# Altium project 双通道模组-测试第一版.PrjPCB
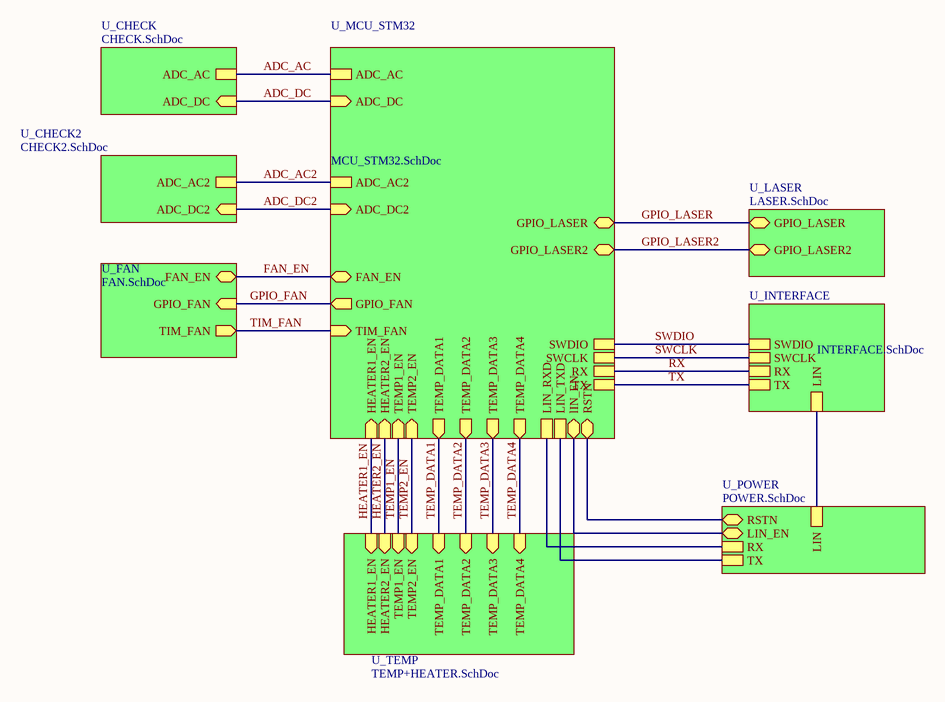
[diagram p0: B2-3-2.SchDoc]
9 sheets, 124 parts. Net scope: global (net labels, ports and power ports of the same name join across sheets).
Board files: B6-1-2.PcbDoc, B6V2.PcbDoc, PCB1.PcbDoc
Sheets:
  B2-3-2.SchDoc
    U_CHECK = CHECK.SchDoc
    U_FAN = FAN.SchDoc
    U_INTERFACE = INTERFACE.SchDoc
    U_LASER = LASER.SchDoc
    U_MCU_STM32 = MCU_STM32.SchDoc
    U_POWER = POWER.SchDoc
    U_CHECK2 = CHECK2.SchDoc
    U_TEMP = TEMP+HEATER.SchDoc

## Sheet B2-3-2.SchDoc
size A4

### Sub-sheets
U_CHECK = CHECK.SchDoc: ADC_AC, ADC_DC (in)
U_CHECK2 = CHECK2.SchDoc: ADC_AC2, ADC_DC2 (in)
U_FAN = FAN.SchDoc: GPIO_FAN (in), TIM_FAN (out), FAN_EN
U_INTERFACE = INTERFACE.SchDoc: SWDIO, SWCLK, RX, TX, LIN
U_LASER = LASER.SchDoc: GPIO_LASER, GPIO_LASER2
U_MCU_STM32 = MCU_STM32.SchDoc: ADC_AC, SWDIO, SWCLK, RX, TX, TIM_FAN (in), GPIO_FAN (out), GPIO_LASER, GPIO_LASER2, FAN_EN, ADC_AC2, TEMP_DATA2 (out), TEMP_DATA1 (out), TEMP_DATA3 (out), TEMP_DATA4 (out), LIN_TXD, LIN_RXD, lIN_EN, RSTN, ADC_DC (in), ADC_DC2 (in), TEMP2_EN (in), TEMP1_EN (in), HEATER2_EN (in), HEATER1_EN (in)
U_POWER = POWER.SchDoc: RX, TX, LIN, LIN_EN, RSTN
U_TEMP = TEMP+HEATER.SchDoc: TEMP_DATA2 (in), TEMP_DATA1 (in), TEMP_DATA3 (in), TEMP_DATA4 (in), TEMP1_EN (in), TEMP2_EN (in), HEATER2_EN (in), HEATER1_EN (in)

### Nets
ADC_AC: sheet U_CHECK/ADC_AC, sheet U_MCU_STM32/ADC_AC
ADC_AC2: sheet U_MCU_STM32/ADC_AC2, sheet U_CHECK2/ADC_AC2
ADC_DC: sheet U_CHECK/ADC_DC, sheet U_MCU_STM32/ADC_DC
ADC_DC2: sheet U_MCU_STM32/ADC_DC2, sheet U_CHECK2/ADC_DC2
FAN_EN: sheet U_FAN/FAN_EN, sheet U_MCU_STM32/FAN_EN
GPIO_FAN: sheet U_FAN/GPIO_FAN, sheet U_MCU_STM32/GPIO_FAN
GPIO_LASER: sheet U_LASER/GPIO_LASER, sheet U_MCU_STM32/GPIO_LASER
GPIO_LASER2: sheet U_LASER/GPIO_LASER2, sheet U_MCU_STM32/GPIO_LASER2
HEATER1_EN: sheet U_MCU_STM32/HEATER1_EN, sheet U_TEMP/HEATER1_EN
HEATER2_EN: sheet U_MCU_STM32/HEATER2_EN, sheet U_TEMP/HEATER2_EN
RX: sheet U_INTERFACE/RX, sheet U_MCU_STM32/RX
SWCLK: sheet U_INTERFACE/SWCLK, sheet U_MCU_STM32/SWCLK
SWDIO: sheet U_INTERFACE/SWDIO, sheet U_MCU_STM32/SWDIO
TEMP1_EN: sheet U_MCU_STM32/TEMP1_EN, sheet U_TEMP/TEMP1_EN
TEMP2_EN: sheet U_MCU_STM32/TEMP2_EN, sheet U_TEMP/TEMP2_EN
TEMP_DATA1: sheet U_MCU_STM32/TEMP_DATA1, sheet U_TEMP/TEMP_DATA1
TEMP_DATA2: sheet U_MCU_STM32/TEMP_DATA2, sheet U_TEMP/TEMP_DATA2
TEMP_DATA3: sheet U_MCU_STM32/TEMP_DATA3, sheet U_TEMP/TEMP_DATA3
TEMP_DATA4: sheet U_MCU_STM32/TEMP_DATA4, sheet U_TEMP/TEMP_DATA4
TIM_FAN: sheet U_FAN/TIM_FAN, sheet U_MCU_STM32/TIM_FAN
TX: sheet U_INTERFACE/TX, sheet U_MCU_STM32/TX
(unnamed): sheet U_INTERFACE/LIN, sheet U_POWER/LIN
(unnamed): sheet U_MCU_STM32/LIN_TXD, sheet U_POWER/TX
(unnamed): sheet U_MCU_STM32/LIN_RXD, sheet U_POWER/RX
(unnamed): sheet U_MCU_STM32/lIN_EN, sheet U_POWER/LIN_EN
(unnamed): sheet U_MCU_STM32/RSTN, sheet U_POWER/RSTN

## Sheet CHECK.SchDoc
size A4
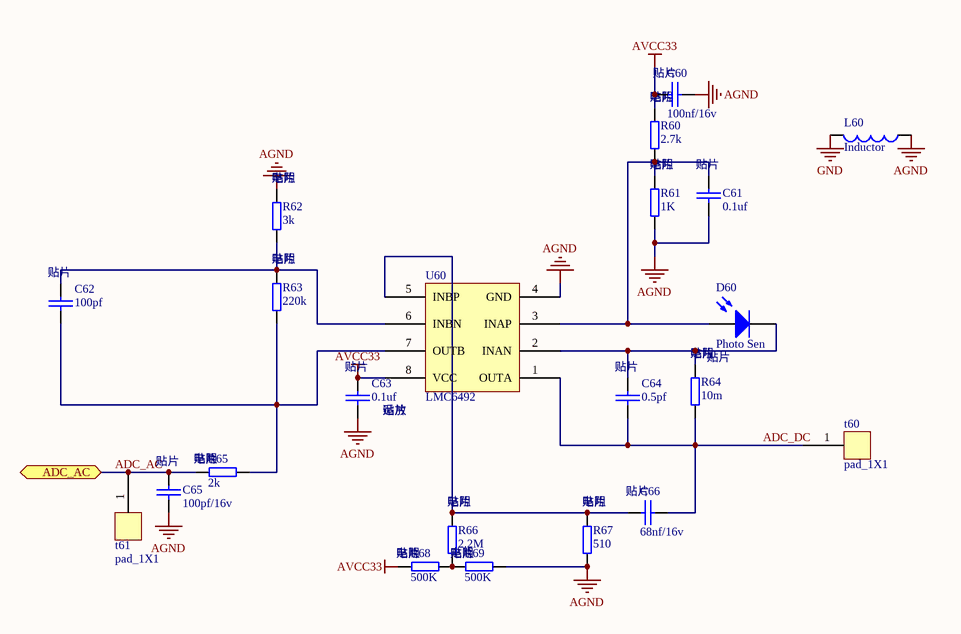
[diagram p1: CHECK.SchDoc]

### Parts
C60  100nf/16v  [C0402]
C61  0.1uf  [C0402]
C62  100pf  [C0402]
C63  0.1uf  [C0402]
C64  0.5pf  [C0402]
C65  100pf/16v  [C0402]
C66  68nf/16v  [C0402]
D60  Photo Sen  [PhotoSen]
L60  Inductor  [L0402]
R60  2.7k  [R0402]
R61  1K  [R0402]
R62  3k  [R0402]
R63  220k  [R0402]
R64  10m  [R0402]
R65  2k  [R0402]
R66  2.2M  [R0402]
R67  510  [R0402]
R68  500K  [R0402]
R69  500K  [R0402]
t60  pad_1X1  [pad_0603]
t61  pad_1X1  [pad_0603]
U60  LMC6492  [SO-8]

### Ports
ADC_AC

### Nets
AGND: C60.2 C61.2 C63.2 C65.1 L60.1 R61.2 R62.1 R67.2 R69.2 U60.4(GND)
AVCC33: C60.1 C63.1 R60.1 R68.1 U60.8(VCC)
GND: L60.2
ADC_AC: C65.2 R65.1 t61.1 ; port ADC_AC
ADC_DC: C64.2 C66.2 R64.2 t60.1 U60.1(OUTA)
NetC61_1: C61.1 D60.1(A) R60.2 R61.1 U60.3(INAP)
NetC62_1: C62.1 R62.2 R63.1 U60.6(INBN)
NetC62_2: C62.2 R63.2 R65.2 U60.7(OUTB)
NetC64_1: C64.1 D60.2(K) R64.1 U60.2(INAN)
NetC66_1: C66.1 R66.1 R67.1 U60.5(INBP)
NetR66_2: R66.2 R68.2 R69.1

### Notes on the sheet
- (in symbol CC) 贴片
- (in symbol LMC6492) 贴片; 运放
- (in symbol Photo Sen) 贴片
- (in symbol RES1) 电阻; 贴片

### Library data of the parts
C60 C61 C63 = CC: C; 大?: 0.1uf/50v; 封?: 0603
C62 C65 = CC: C; 大?: 100pF/50v; 封?: 0603
C64 = CC: C; 大?: 0.5pf/50v; 封?: 0603
C66 = CC: C; 大?: 68nf/50v; 封?: 0603
D60 = Photo Sen: Photosensitive Diode; 产?: *; 厂?: *; 大?: *; 封?: *; 价?: *; 型?: *; 资?: *
L60 = Inductor: Code_IEC: 1005; Published: 8-Jun-2000; LatestRevisionDate: 29-May-2009; LatestRevisionNote: IPC-7351 Footprint Added.; PackageReference: 0402-A; Publisher: Altium Limited; PackageDescription: Chip Inductor; Code_JEITA: 0402
R60-R69 = RES1: R; 价?: 0.01; 封?: 0603
  R60: 大?: 2.7k
  R61: 大?: 1k
  R62: 大?: 3k
  R63: 大?: 220k
  R64: 大?: 10m
  R65: 大?: 2k
  R66: 大?: 2.2M
  R67: 大?: 510
  R68 R69: 大?: 500K
U60 = LMC6492: 产?: *; 厂?: *; 大?: *; 封?: *; 价?: *; 型?: LMC6492; 资?: *

## Sheet FAN.SchDoc
size A4
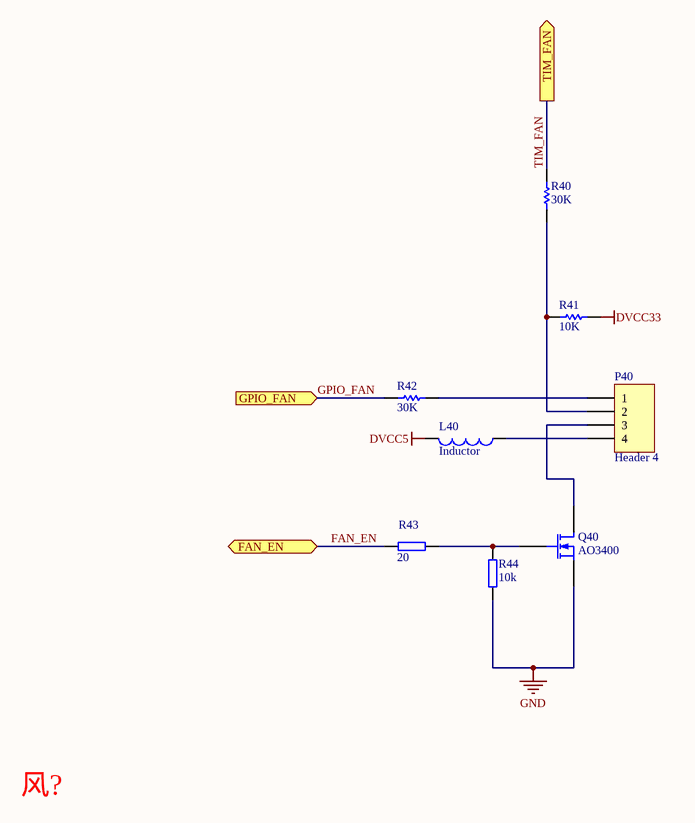
[diagram p2: FAN.SchDoc]

### Parts
L40  Inductor  [L0402]
P40  Header 4  [1.5P-4]
Q40  AO3400  [SI2300]
R40  30K  [R0402]
R41  10K  [R0402]
R42  30K  [R0402]
R43  20  [R0402]
R44  10k  [R0402]

### Ports
FAN_EN, GPIO_FAN (in), TIM_FAN (out)

### Nets
DVCC5: L40.2
DVCC33: R41.1
GND: Q40.3(S) R44.2
FAN_EN: R43.2 ; port FAN_EN
GPIO_FAN: R42.1 ; port GPIO_FAN
TIM_FAN: R40.2 ; port TIM_FAN
NetL40_1: L40.1 P40.4
NetP40_1: P40.1 R42.2
NetP40_2: P40.2 R40.1 R41.2
NetP40_3: P40.3 Q40.1(D)
NetQ40_2: Q40.2(G) R43.1 R44.1

### Notes on the sheet
- 风?

### Library data of the parts
L40 = Inductor: Code_IEC: 1005; Published: 8-Jun-2000; LatestRevisionDate: 29-May-2009; LatestRevisionNote: IPC-7351 Footprint Added.; PackageReference: 0402-A; Publisher: Altium Limited; PackageDescription: Chip Inductor; Code_JEITA: 0402
P40 = Header 4: Header, 4-Pin; LatestRevisionDate: 17-Jul-2002; LatestRevisionNote: Re-released for DXP Platform.; Publisher: Altium Limited
Q40 = MOSFET-N: N-Channel MOSFET; pin to pad: 1>3 2>1 3>2; ·: 贴片; 元件�: N-MOS; 产地: *; 厂商: *; 大小: *; 封装�: *; 型号: AO3400; 物料�: *
R40 R42 = R0402: Resistor 0402; Published: 8-Jun-2000; LatestRevisionDate: 17-Jul-2002; LatestRevisionNote: Re-released for DXP Platform.; PackageReference: AXIAL-0.3; Publisher: Altium Limited; PackageDescription: Axial Device, Thru-Hole; 2 Leads; 0.3 in Pin Spacing; Value: 30K
R41 = R0402: Resistor 0402; Value: 1K; Published: 8-Jun-2000; LatestRevisionDate: 17-Jul-2002; LatestRevisionNote: Re-released for DXP Platform.; PackageReference: AXIAL-0.3; Publisher: Altium Limited; PackageDescription: Axial Device, Thru-Hole; 2 Leads; 0.3 in Pin Spacing
R43 R44 = RES1: Ô: 电阻; 价格: 0.01; ·: 贴片; 封装�: 0603
  R43: 大小: 20
  R44: 大小: 10k

## Sheet INTERFACE.SchDoc
size A4; DocumentNumber: 2; SheetNumber: 2; SheetTotal: 6
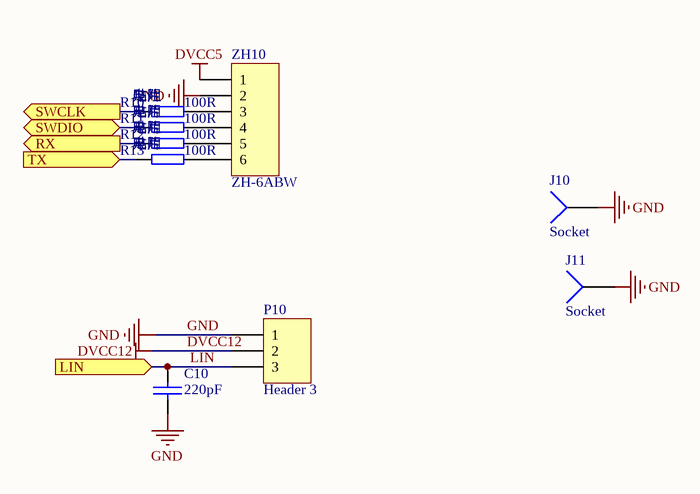
[diagram p3: INTERFACE.SchDoc]

### Parts
C10  220pF  [C0402]
J10  Socket  [SPRING_2SIDES]
J11  Socket  [SPRING_2SIDES]
P10  Header 3  [53426-3]
R10  100R  [R0402]
R11  100R  [R0402]
R12  100R  [R0402]
R13  100R  [R0402]
ZH10  ZH-6ABW  [ZH-6ABW]

### Ports
LIN (in), RX (out), SWCLK (out), SWDIO, TX (in)

### Nets
DVCC5: ZH10.1
DVCC12: P10.2
GND: C10.2 J10.1 J11.1 P10.1 ZH10.2
LIN: C10.1 P10.3 ; port LIN
RX: R12.1 ; port RX
SWCLK: R10.1 ; port SWCLK
SWDIO: R11.1 ; port SWDIO
TX: R13.1 ; port TX
NetR10_2: R10.2 ZH10.3
NetR11_2: R11.2 ZH10.4
NetR12_2: R12.2 ZH10.5
NetR13_2: R13.2 ZH10.6

### Notes on the sheet
- (in symbol RES1) 电阻; 贴片

### Library data of the parts
C10 = CC: 大小: 0.1uf/50v; 封装: 0603
P10 = Header 3: Header, 3-Pin; LatestRevisionDate: 17-Jul-2002; LatestRevisionNote: Re-released for DXP Platform.; Publisher: Altium Limited
R10-R13 = RES1: 价格: 0.01; 封�: 0603; 大小: 10K
ZH10 = ZH-6ABW: 1.5mm; LatestRevisionDate: 17-Jul-2002; LatestRevisionNote: Re-released for DXP Platform.; Publisher: Altium Limited
J10 J11 = Socket: LatestRevisionDate: 17-Jul-2002; LatestRevisionNote: Re-released for DXP Platform.; Publisher: Altium Limited

## Sheet LASER.SchDoc
size A4
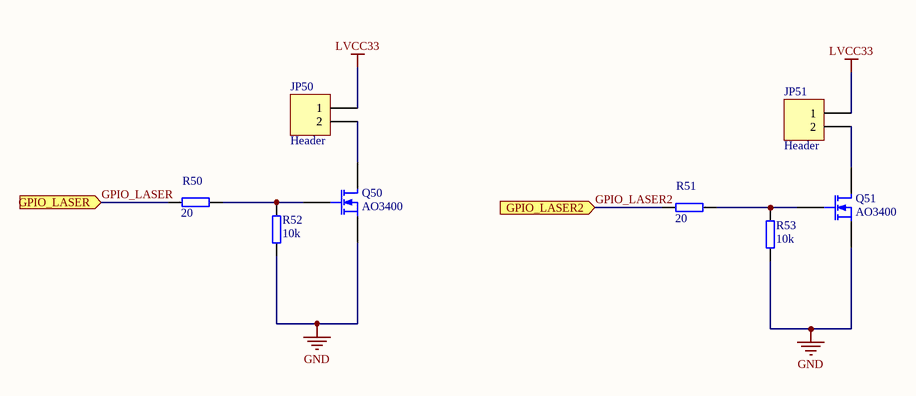
[diagram p4: LASER.SchDoc]

### Parts
JP50  Header  [LASERJACK]
JP51  Header  [LASERJACK]
Q50  AO3400  [SI2300]
Q51  AO3400  [SI2300]
R50  20  [R0402]
R51  20  [R0402]
R52  10k  [R0402]
R53  10k  [R0402]

### Ports
GPIO_LASER2 (in), GPIO_LASER (in)

### Nets
GND: Q50.3(S) Q51.3(S) R52.2 R53.2
LVCC33: JP50.1 JP51.1
GPIO_LASER: R50.2 ; port GPIO_LASER
GPIO_LASER2: R51.2 ; port GPIO_LASER2
NetJP50_2: JP50.2 Q50.1(D)
NetJP51_2: JP51.2 Q51.1(D)
NetQ50_2: Q50.2(G) R50.1 R52.1
NetQ51_2: Q51.2(G) R51.1 R53.1

### Library data of the parts
JP50 JP51 = Header 2: Header, 2-Pin; 封装|UNIQUEID: 插装; 元: 1.5mm接插件; 产地: *; 厂商: *; 大小: *; 封装类型|UNIQUEID: *; 资料名称|UNIQUEID: *; 价格: *
Q50 Q51 = MOSFET-N: N-Channel MOSFET; pin to pad: 1>3 2>1 3>2; ·: 贴片; 元件�: N-MOS; 产地: *; 厂商: *; 大小: *; 封装�: *; 型号: AO3400; 物料�: *
R50-R53 = RES1: Ô: 电阻; 价格: 0.01; ·: 贴片; 封装�: 0603
  R50 R51: 大小: 20
  R52 R53: 大小: 10k

## Sheet MCU_STM32.SchDoc
size A3; DocumentNumber: 4; SheetNumber: 4; SheetTotal: 6
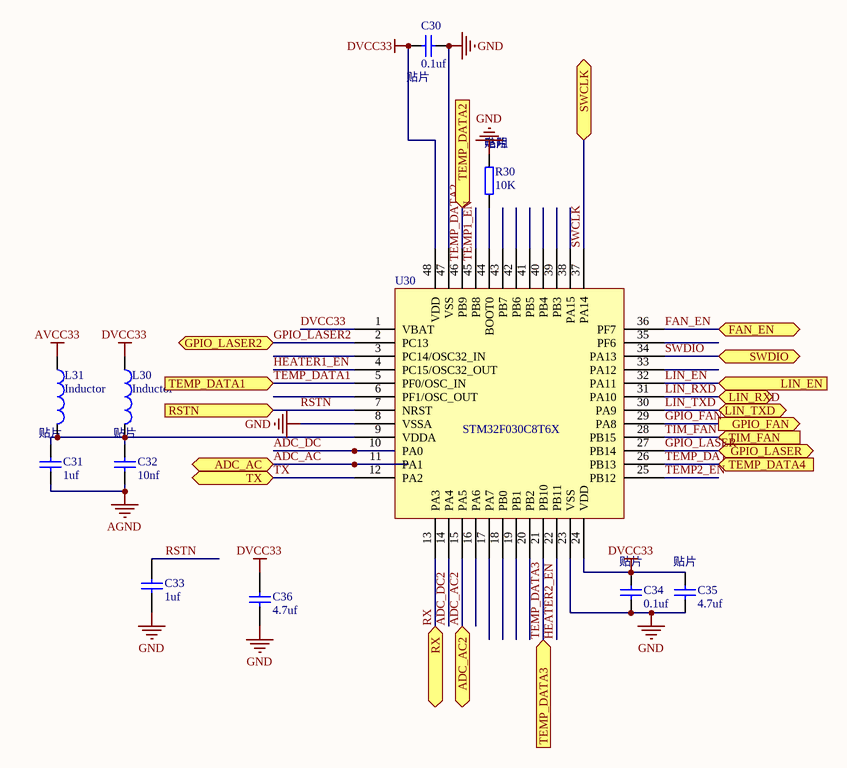
[diagram p5: MCU_STM32.SchDoc]

### Parts
C30  0.1uf  [C0402]
C31  1uf  [C0402]
C32  10nf  [C0402]
C33  1uf  [C0402]
C34  0.1uf  [C0402]
C35  4.7uf  [C0402]
C36  4.7uf  [C0402]
L30  Inductor  [L0402]
L31  Inductor  [L0402]
R30  10K  [R0402]
U30  STM32F030C8T6X  [LQFP48S]

### Ports
ADC_AC, ADC_AC2, FAN_EN, GPIO_FAN (out), GPIO_LASER, GPIO_LASER2, LIN_EN (in), LIN_RXD, LIN_TXD, RSTN (in), RX, SWCLK, SWDIO, TEMP_DATA1 (in), TEMP_DATA2 (in), TEMP_DATA3 (in), TEMP_DATA4 (in), TIM_FAN (in), TX

### Nets
AGND: C31.2 C32.2
AVCC33: L31.2
DVCC33: C30.1 C34.1 C35.1 C36.2 L30.2 U30.1(VBAT) U30.24(VDD) U30.48(VDD)
GND: C30.2 C33.1 C34.2 C35.2 C36.1 R30.1 U30.8(VSSA) U30.23(VSS) U30.47(VSS)
ADC_AC: U30.11(PA1) ; port ADC_AC
ADC_AC2: U30.15(PA5) ; port ADC_AC2
ADC_DC: U30.10(PA0)
ADC_DC2: U30.14(PA4)
FAN_EN: U30.36(PF7) ; port FAN_EN
GPIO_FAN: U30.29(PA8) ; port GPIO_FAN
GPIO_LASER: U30.27(PB14) ; port GPIO_LASER
GPIO_LASER2: U30.2(PC13) ; port GPIO_LASER2
HEATER1_EN: U30.4(PC15/OSC32_OUT)
HEATER2_EN: U30.22(PB11)
LIN_EN: U30.32(PA11) ; port LIN_EN
LIN_RXD: U30.31(PA10) ; port LIN_RXD
LIN_TXD: U30.30(PA9) ; port LIN_TXD
RSTN: C33.2 U30.7(NRST) ; port RSTN
RX: U30.13(PA3) ; port RX
SWCLK: U30.37(PA14) ; port SWCLK
SWDIO: U30.34(PA13) ; port SWDIO
TEMP2_EN: U30.25(PB12)
TEMP_DATA1: U30.5(PF0/OSC_IN) ; port TEMP_DATA1
TEMP_DATA2: U30.46(PB9) ; port TEMP_DATA2
TEMP_DATA3: U30.21(PB10) ; port TEMP_DATA3
TEMP_DATA4: U30.26(PB13) ; port TEMP_DATA4
TIM_FAN: U30.28(PB15) ; port TIM_FAN
TX: U30.12(PA2) ; port TX
NetC31_1: C31.1 C32.1 L30.1 L31.1 U30.9(VDDA)
NetR30_2: R30.2 U30.44(BOOT0)

Not connected (* = marked no-connect by the designer): U30 3(PC14/OSC32_IN) 6(PF1/OSC_OUT) 16(PA6) 17(PA7) 18(PB0) 19(PB1) 20(PB2) 33(PA12) 35(PF6) 38(PA15) 39(PB3) 40(PB4) 41(PB5) 42(PB6) 43(PB7) 45(PB8)

### Notes on the sheet
- Labels drawn without touching a wire or pin: TEMP1_EN, TEMP_DATA2
- (in symbol Cap Semi) 贴片
- (in symbol RES1) 电阻; 贴片

### Library data of the parts
C30 C34 = Cap Semi: Capacitor (Semiconductor SIM Model); 大?: 0.1uf/50v; 封?: 0603; 产?: *; 厂?: *; 型?: *; 物?: *
C31 = Cap Semi: Capacitor (Semiconductor SIM Model); 大?: 1uf/16v; 封?: 0603; 产?: *; 厂?: *; 型?: *; 物?: *
C32 C35 = Cap Semi: Capacitor (Semiconductor SIM Model); 封?: 0603; 产?: *; 厂?: *; 型?: *; 物?: *
  C32: 大?: 10nf
  C35: 大?: 4.7uf
C33 = C0402: Capacitor 0402; Value: 1uf/16v; Published: 8-Jun-2000; LatestRevisionDate: 17-Jul-2002; LatestRevisionNote: Re-released for DXP Platform.; PackageReference: RAD-0.3; Publisher: Altium Limited; PackageDescription: Radial Cap, Thru-Hole; 2 Leads; 0.3 in Pin Spacing
C36 = C0402: Capacitor 0402; Published: 8-Jun-2000; LatestRevisionDate: 17-Jul-2002; LatestRevisionNote: Re-released for DXP Platform.; PackageReference: RAD-0.3; Publisher: Altium Limited; PackageDescription: Radial Cap, Thru-Hole; 2 Leads; 0.3 in Pin Spacing; Value: 4.7uf
L30 L31 = Inductor: Code_IEC: 1005; Published: 8-Jun-2000; LatestRevisionDate: 29-May-2009; LatestRevisionNote: IPC-7351 Footprint Added.; PackageReference: 0402-A; Publisher: Altium Limited; PackageDescription: Chip Inductor; Code_JEITA: 0402
R30 = RES1: 价?: 0.01; 封?: 0603; 大?: 10K

## Sheet POWER.SchDoc
size A4
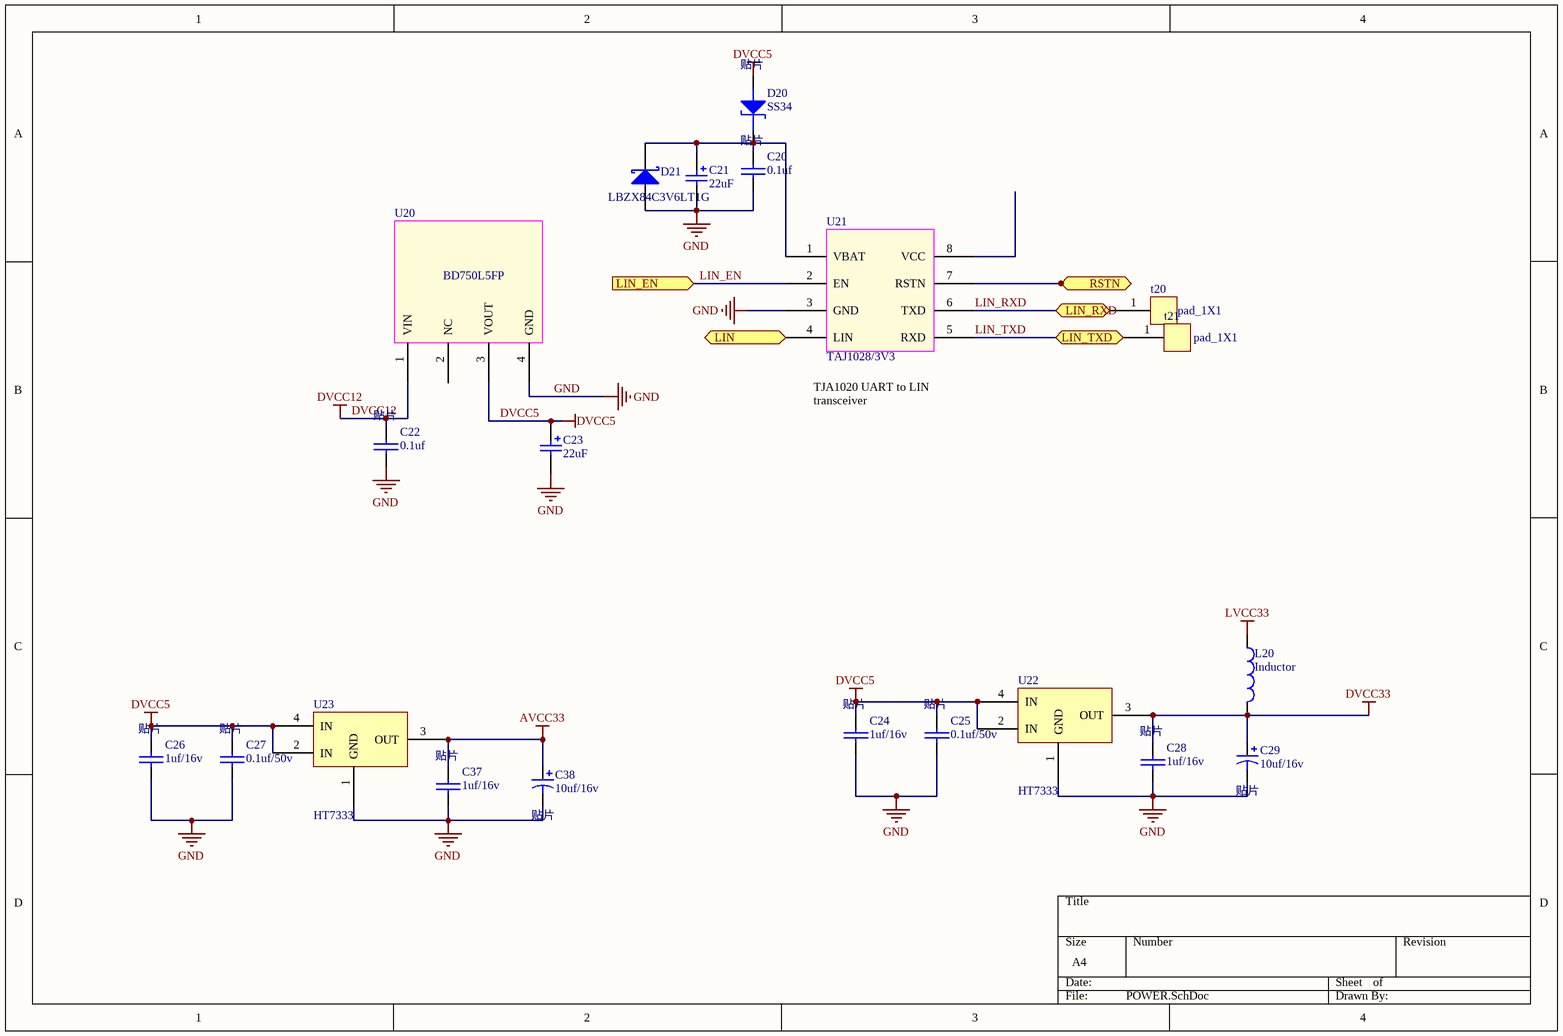
[diagram p6: POWER.SchDoc]

### Parts
C20  0.1uf  [C0402]
C21  22uF  [C0603]
C22  0.1uf  [C0402]
C23  22uF  [C0603]
C24  1uf/16v  [C0402]
C25  0.1uf/50v  [C0402]
C26  1uf/16v  [C0402]
C27  0.1uf/50v  [C0402]
C28  1uf/16v  [C0402]
C29  10uf/16v  [AVX_A]
C37  1uf/16v  [C0402]
C38  10uf/16v  [AVX_A]
D20  SS34  [BGY220D]
D21  LBZX84C3V6LT1G  [SOT-23_N]
L20  Inductor  [L0402]
t20  pad_1X1  [pad_0603]
t21  pad_1X1  [pad_0603]
U20  BD750L5FP  [TO252-3]
U21  TAJ1028/3V3  [SO-8]
U22  HT7333  [SOT-89]
U23  HT7333  [SOT-89]

### Ports
LIN (in), LIN_EN (in), LIN_RXD, LIN_TXD, RSTN

### Nets
AVCC33: C37.1 C38.1 U23.3(OUT)
DVCC5: C23.1 C24.1 C25.1 C26.1 C27.1 D20.1(A) U20.3(VOUT) U22.2(IN) U22.4(IN) U23.2(IN) U23.4(IN)
DVCC12: C22.1 U20.1(VIN)
DVCC33: C28.1 C29.1 L20.2 U22.3(OUT)
GND: C20.2 C21.2 C22.2 C23.2 C24.2 C25.2 C26.2 C27.2 C28.2 C29.2 C37.2 C38.2 D21.1(A) U20.4(GND) U21.3(GND) U22.1(GND) U23.1(GND)
LVCC33: L20.1
LIN: U21.4(LIN) ; port LIN
LIN_EN: U21.2(EN) ; port LIN_EN
LIN_RXD: t20.1 U21.6(TXD) ; port LIN_RXD
LIN_TXD: t21.1 U21.5(RXD) ; port LIN_TXD
RSTN: U21.7(RSTN) ; port RSTN
NetC20_1: C20.1 C21.1 D20.2(K) D21.3(K) U21.1(VBAT)

Not connected (* = marked no-connect by the designer): U20 2(NC); U21 8(VCC)

### Notes on the sheet
- (near U21) TJA1020 UART to LIN transceiver
- (in symbol 1N5819) 贴片
- (in symbol Cap Pol3) 贴片
- (in symbol CC) 贴片

### Library data of the parts
C20 C22 = CC: 大小: 0.1uf/50v; 封?: 0603
C21 C23 = CTaA: Tantalum Capacitor A; Published: 8-Jun-2000; LatestRevisionDate: 29-May-2009; LatestRevisionNote: IPC-7351 Footprint Added.; PackageReference: 3216; Publisher: Altium Limited; PackageDescription: Chip Capacitor; Value: 22uF
C24-C28 C37 = CC: 封?: 0603
  C24 C26 C28 C37: 大?: 1uf/16v
  C25 C27: 大?: 0.1uf/50v
C29 C38 = Cap Pol3: Polarized Capacitor (Surface Mount); 封?: CE4.3*4.3; 大?: 10uf/16v; 价?: *; 型?: *; 资?: *
D20 = 1N5819: 型?: 1N5819/SS14; 产?: *; 厂?: *; 大?: *; 封?: *; 价?: *; 资?: *
D21 = Diode BAS70: Silicon AF Schottky Diode for High-Speed Switching; Note: Pin 2 is not connected and not drawn.; Published: 21-Mar-2003; LatestRevisionDate: 29-May-2009; LatestRevisionNote: IPC-7351 Footprint Added.; DatasheetVersion: Oct-1999; PackageVersion: Sep-2001; PackageReference: SOT-23; Publisher: Altium Limited; PackageDescription: 3-Pin SOT-23 Package 0.95 mm Pitch, 2.5 mm Lead Span; ComponentLink1Description: Manufacturer Link; ComponentLink1URL: http://www.infineon.com/; ComponentLink2Description: Datasheet; ComponentLink2URL: http://www.infineon.com/upload/Document/cmc_upload/documents/009/382/bas40_bas140series_1.pdf
L20 = Inductor: Code_IEC: 1005; Published: 8-Jun-2000; LatestRevisionDate: 29-May-2009; LatestRevisionNote: IPC-7351 Footprint Added.; PackageReference: 0402-A; Publisher: Altium Limited; PackageDescription: Chip Inductor; Code_JEITA: 0402
U20 = BD733L5FP
U21 = TAJ1020

## Sheet CHECK2.SchDoc
size A4
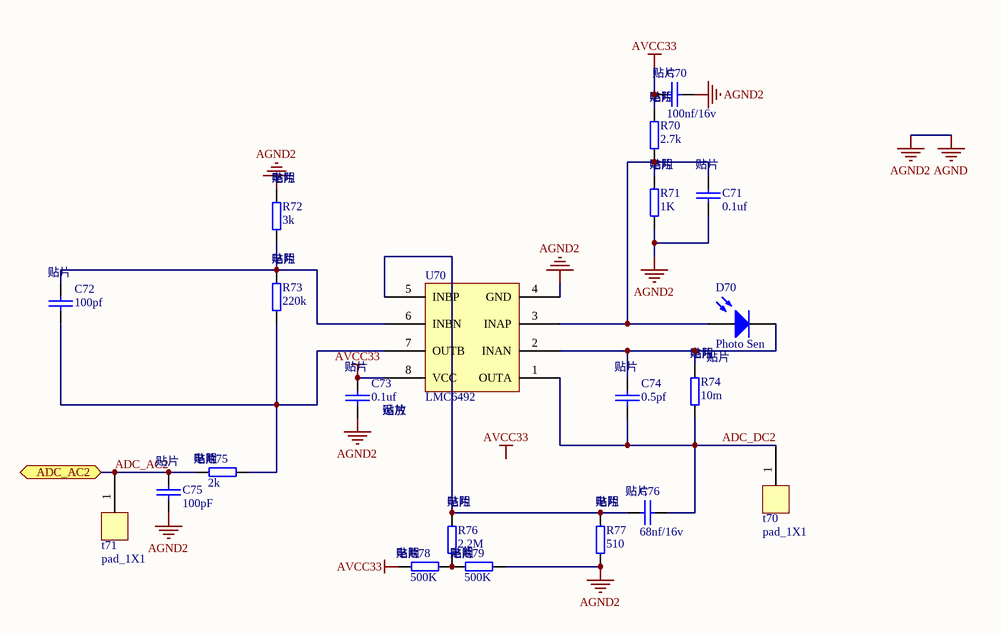
[diagram p7: CHECK2.SchDoc]

### Parts
C70  100nf/16v  [C0402]
C71  0.1uf  [C0402]
C72  100pf  [C0402]
C73  0.1uf  [C0402]
C74  0.5pf  [C0402]
C75  100pF  [C0402]
C76  68nf/16v  [C0402]
D70  Photo Sen  [PhotoSen]
R70  2.7k  [R0402]
R71  1K  [R0402]
R72  3k  [R0402]
R73  220k  [R0402]
R74  10m  [R0402]
R75  2k  [R0402]
R76  2.2M  [R0402]
R77  510  [R0402]
R78  500K  [R0402]
R79  500K  [R0402]
t70  pad_1X1  [pad_0603]
t71  pad_1X1  [pad_0603]
U70  LMC6492  [SO-8]

### Ports
ADC_AC2

### Nets
AGND: C70.2 C71.2 C73.2 C75.1 R71.2 R72.1 R77.2 R79.2 U70.4(GND)  [also labelled AGND2]
AVCC33: C70.1 C73.1 R70.1 R78.1 U70.8(VCC)
ADC_AC2: C75.2 R75.1 t71.1 ; port ADC_AC2
ADC_DC2: C74.2 C76.2 R74.2 t70.1 U70.1(OUTA)
NetC71_1: C71.1 D70.1(A) R70.2 R71.1 U70.3(INAP)
NetC72_1: C72.1 R72.2 R73.1 U70.6(INBN)
NetC72_2: C72.2 R73.2 R75.2 U70.7(OUTB)
NetC74_1: C74.1 D70.2(K) R74.1 U70.2(INAN)
NetC76_1: C76.1 R76.1 R77.1 U70.5(INBP)
NetR76_2: R76.2 R78.2 R79.1

### Notes on the sheet
- Labels drawn without touching a wire or pin: AVCC33
- (in symbol CC) 贴片
- (in symbol LMC6492) 贴片; 运放
- (in symbol Photo Sen) 贴片
- (in symbol RES1) 电阻; 贴片

### Library data of the parts
C70 C71 C73 = CC: C; 大?: 0.1uf/50v; 封?: 0603
C72 C75 = CC: C; 大?: 100pF/50v; 封?: 0603
C74 = CC: C; 大?: 0.5pf/50v; 封?: 0603
C76 = CC: C; 大?: 68nf/50v; 封?: 0603
D70 = Photo Sen: Photosensitive Diode; 产?: *; 厂?: *; 大?: *; 封?: *; 价?: *; 型?: *; 资?: *
R70-R79 = RES1: R; 价?: 0.01; 封?: 0603
  R70: 大?: 2.7k
  R71: 大?: 1k
  R72: 大?: 3k
  R73: 大?: 220k
  R74: 大?: 10m
  R75: 大?: 2k
  R76: 大?: 2.2M
  R77: 大?: 510
  R78 R79: 大?: 500K
U70 = LMC6492: 产?: *; 厂?: *; 大?: *; 封?: *; 价?: *; 型?: LMC6492; 资?: *

## Sheet TEMP+HEATER.SchDoc
size A4
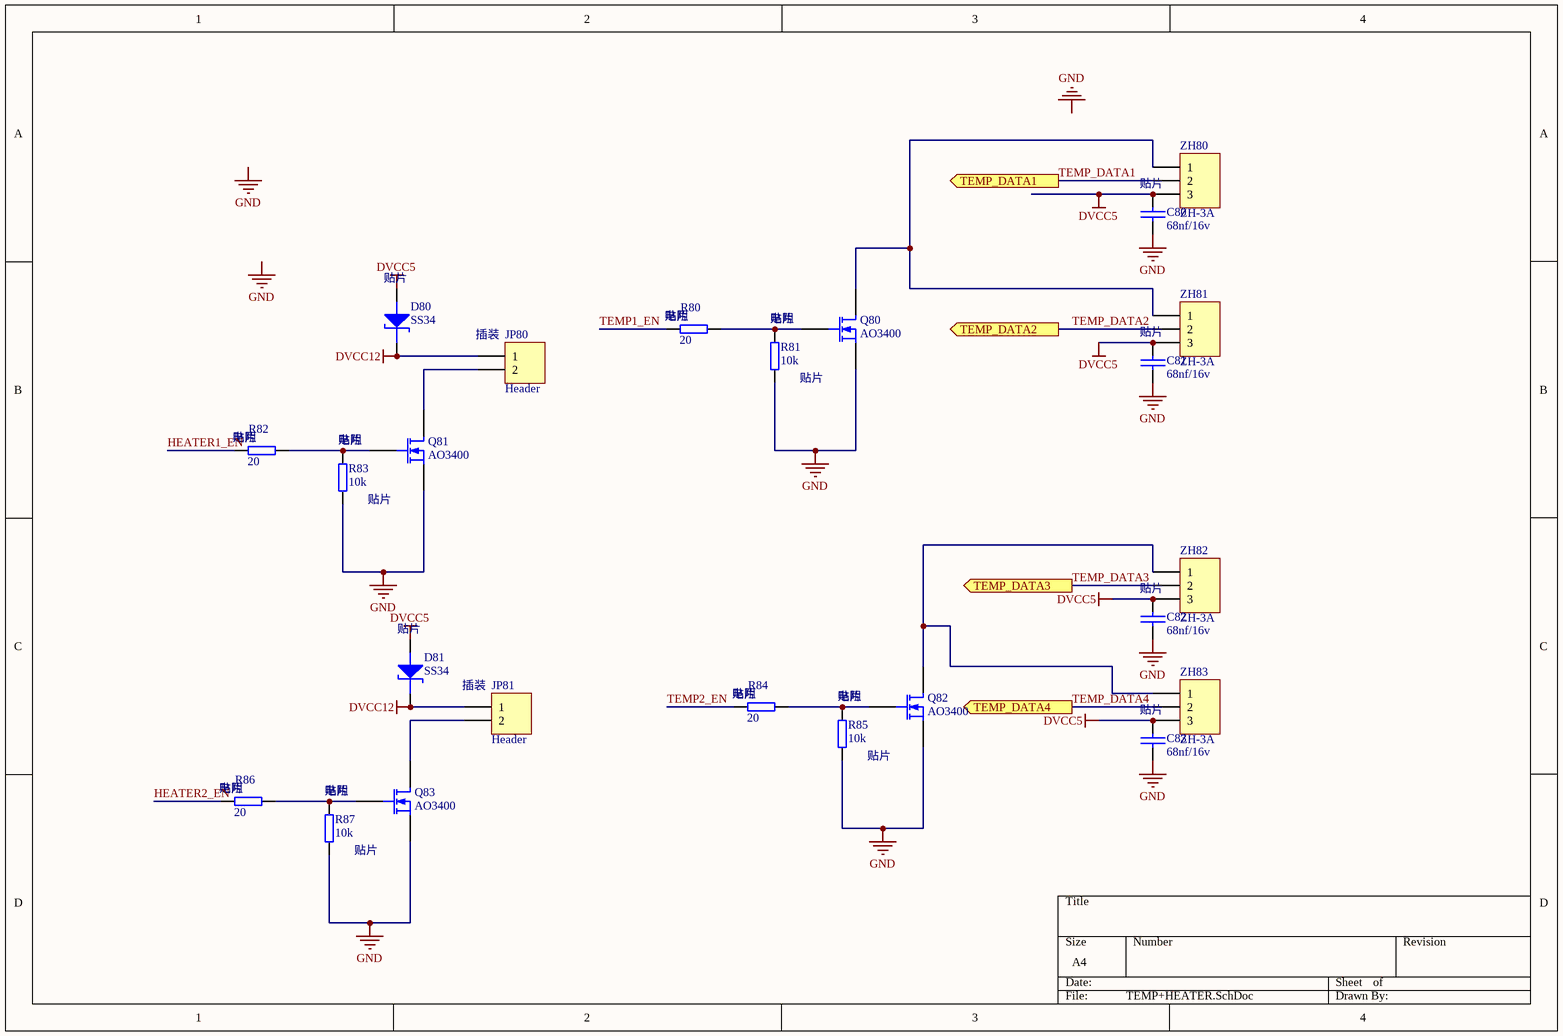
[diagram p8: TEMP+HEATER.SchDoc]

### Parts
C80  68nf/16v  [C0402]
C81  68nf/16v  [C0402]
C82  68nf/16v  [C0402]
C83  68nf/16v  [C0402]
D80  SS34  [BGY220D]
D81  SS34  [BGY220D]
JP80  Header  [PTC]
JP81  Header  [PTC]
Q80  AO3400  [SI2300]
Q81  AO3400  [SI2300]
Q82  AO3400  [SI2300]
Q83  AO3400  [SI2300]
R80  20  [R0402]
R81  10k  [R0402]
R82  20  [R0402]
R83  10k  [R0402]
R84  20  [R0402]
R85  10k  [R0402]
R86  20  [R0402]
R87  10k  [R0402]
ZH80  ZH-3A  [DS18B20]
ZH81  ZH-3A  [DS18B20]
ZH82  ZH-3A  [DS18B20]
ZH83  ZH-3A  [DS18B20]

### Ports
TEMP_DATA1 (out), TEMP_DATA2 (out), TEMP_DATA3 (out), TEMP_DATA4 (out)

### Nets
DVCC5: C80.2 C81.2 C82.2 C83.2 D80.1(A) D81.1(A) ZH80.3 ZH81.3 ZH82.3 ZH83.3
DVCC12: D80.2(K) D81.2(K) JP80.1 JP81.1
GND: C80.1 C81.1 C82.1 C83.1 Q80.3(S) Q81.3(S) Q82.3(S) Q83.3(S) R81.2 R83.2 R85.2 R87.2
HEATER1_EN: R82.2
HEATER2_EN: R86.2
TEMP1_EN: R80.2
TEMP2_EN: R84.2
TEMP_DATA1: ZH80.2 ; port TEMP_DATA1
TEMP_DATA2: ZH81.2 ; port TEMP_DATA2
TEMP_DATA3: ZH82.2 ; port TEMP_DATA3
TEMP_DATA4: ZH83.2 ; port TEMP_DATA4
NetJP80_2: JP80.2 Q81.1(D)
NetJP81_2: JP81.2 Q83.1(D)
NetQ80_1: Q80.1(D) ZH80.1 ZH81.1
NetQ80_2: Q80.2(G) R80.1 R81.1
NetQ81_2: Q81.2(G) R82.1 R83.1
NetQ82_1: Q82.1(D) ZH82.1 ZH83.1
NetQ82_2: Q82.2(G) R84.1 R85.1
NetQ83_2: Q83.2(G) R86.1 R87.1

### Notes on the sheet
- Labels drawn without touching a wire or pin: GND
- (in symbol 1N5819) 贴片
- (in symbol CC) 贴片
- (in symbol Header 2) 插装
- (in symbol MOSFET-N) 贴片
- (in symbol RES1) 电阻; 贴片

### Library data of the parts
C80-C83 = CC: C; 大?: 0.1uf/50v; 封?: 0603
D80 D81 = 1N5819: 型?: 1N5819/SS14; 产?: *; 厂?: *; 大?: *; 封?: *; 价?: *; 资?: *
JP80 JP81 = Header 2: Header, 2-Pin; 产地: *; 厂商: *; 大小: *; 封?: *; 资?: *; 价格: *
Q80-Q83 = MOSFET-N: N-Channel MOSFET; pin to pad: 1>3 2>1 3>2; 元?: N-MOS; 产地: *; 厂商: *; 大小: *; 封?: *; 型号: AO3400; 物?: *
R80-R87 = RES1: 价格: 0.01; 封?: 0603
  R80 R82 R84 R86: 大小: 20
  R81 R83 R85 R87: 大小: 10k
ZH80-ZH83 = ZH-3A: 1.5mm; LatestRevisionDate: 17-Jul-2002; LatestRevisionNote: Re-released for DXP Platform.; Publisher: Altium Limited

## Nets that join several sheets
AGND: CHECK (10 pins), MCU_STM32 (C31.2 C32.2), CHECK2 (9 pins)
AVCC33: CHECK (5 pins), MCU_STM32 (L31.2), POWER (C37.1 C38.1 U23.3), CHECK2 (5 pins)
DVCC5: FAN (L40.2), INTERFACE (ZH10.1), POWER (11 pins), TEMP+HEATER (10 pins)
DVCC12: INTERFACE (P10.2), POWER (C22.1 U20.1), TEMP+HEATER (D80.2 D81.2 JP80.1 JP81.1)
DVCC33: FAN (R41.1), MCU_STM32 (8 pins), POWER (C28.1 C29.1 L20.2 U22.3)
GND: CHECK (L60.2), FAN (Q40.3 R44.2), INTERFACE (5 pins), LASER (Q50.3 Q51.3 R52.2 R53.2), MCU_STM32 (9 pins), POWER (17 pins), TEMP+HEATER (12 pins)
LVCC33: LASER (JP50.1 JP51.1), POWER (L20.1)
ADC_AC: CHECK (C65.2 R65.1 t61.1), MCU_STM32 (U30.11)
ADC_AC2: MCU_STM32 (U30.15), CHECK2 (C75.2 R75.1 t71.1)
ADC_DC: CHECK (5 pins), MCU_STM32 (U30.10)
ADC_DC2: MCU_STM32 (U30.14), CHECK2 (5 pins)
FAN_EN: FAN (R43.2), MCU_STM32 (U30.36)
GPIO_FAN: FAN (R42.1), MCU_STM32 (U30.29)
GPIO_LASER: LASER (R50.2), MCU_STM32 (U30.27)
GPIO_LASER2: LASER (R51.2), MCU_STM32 (U30.2)
HEATER1_EN: MCU_STM32 (U30.4), TEMP+HEATER (R82.2)
HEATER2_EN: MCU_STM32 (U30.22), TEMP+HEATER (R86.2)
LIN: INTERFACE (C10.1 P10.3), POWER (U21.4)
LIN_EN: MCU_STM32 (U30.32), POWER (U21.2)
LIN_RXD: MCU_STM32 (U30.31), POWER (t20.1 U21.6)
LIN_TXD: MCU_STM32 (U30.30), POWER (t21.1 U21.5)
RSTN: MCU_STM32 (C33.2 U30.7), POWER (U21.7)
RX: INTERFACE (R12.1), MCU_STM32 (U30.13)
SWCLK: INTERFACE (R10.1), MCU_STM32 (U30.37)
SWDIO: INTERFACE (R11.1), MCU_STM32 (U30.34)
TEMP2_EN: MCU_STM32 (U30.25), TEMP+HEATER (R84.2)
TEMP_DATA1: MCU_STM32 (U30.5), TEMP+HEATER (ZH80.2)
TEMP_DATA2: MCU_STM32 (U30.46), TEMP+HEATER (ZH81.2)
TEMP_DATA3: MCU_STM32 (U30.21), TEMP+HEATER (ZH82.2)
TEMP_DATA4: MCU_STM32 (U30.26), TEMP+HEATER (ZH83.2)
TIM_FAN: FAN (R40.2), MCU_STM32 (U30.28)
TX: INTERFACE (R13.1), MCU_STM32 (U30.12)